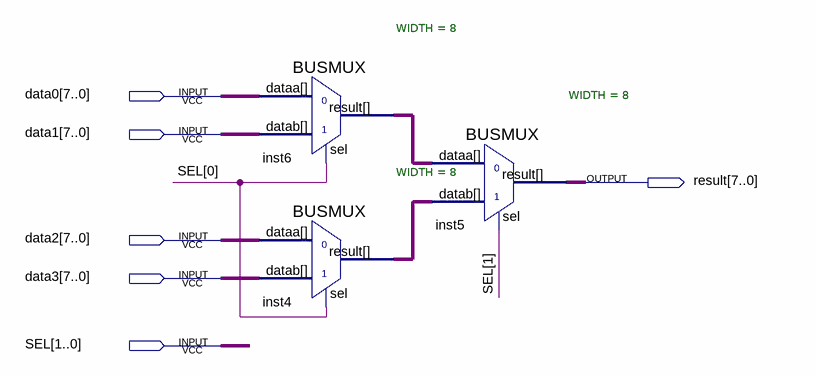
[diagram p0: schematic sheet]
// Quartus schematic 4-1MUX.bdf as structural Verilog: 3 symbols, 6 pins
module \4-1MUX  (
  input  [7:0] data0,
  input  [7:0] data1,
  input  [7:0] data2,
  input  [7:0] data3,
  input  [1:0] SEL,
  output [7:0] result
);

  wire [7:0] inst4_result, inst6_result;

  BUSMUX #(.WIDTH(8)) inst6 (.datab(data1), .sel(SEL[0]), .dataa(data0), .result(inst6_result));
  BUSMUX #(.WIDTH(8)) inst4 (.datab(data3), .sel(SEL[0]), .dataa(data2), .result(inst4_result));
  BUSMUX #(.WIDTH(8)) inst5 (.datab(inst4_result), .sel(SEL[1]), .dataa(inst6_result), .result(result));
endmodule
